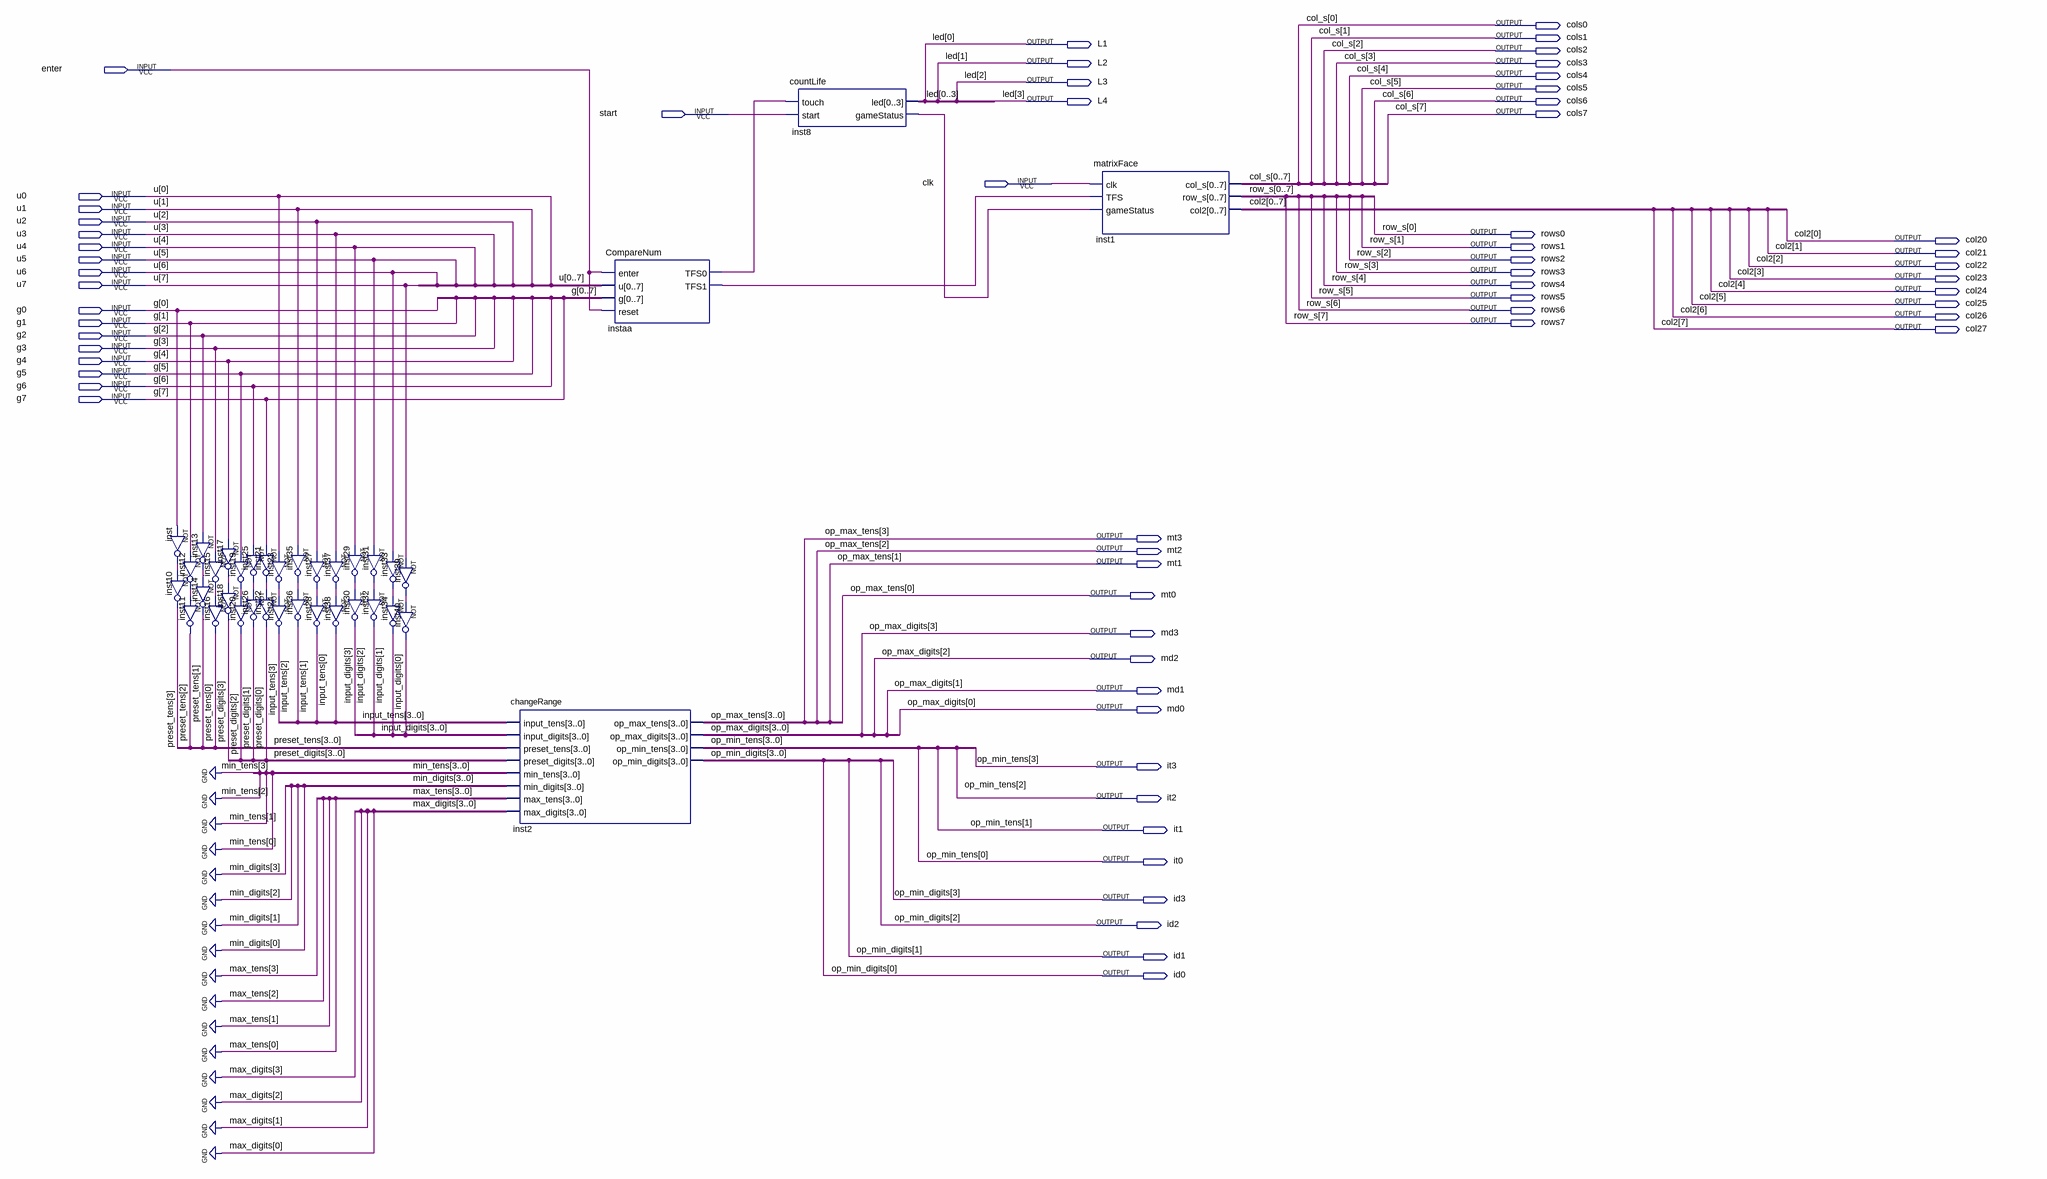
[diagram p0: schematic sheet]
// Quartus schematic projectFull.bdf as structural Verilog: 36 symbols, 63 pins
module projectFull (
  input  enter,
  input  start,
  input  clk,
  input  u0,
  input  u1,
  input  u2,
  input  u3,
  input  u4,
  input  u5,
  input  u6,
  input  u7,
  input  g0,
  input  g1,
  input  g2,
  input  g3,
  input  g4,
  input  g5,
  input  g6,
  input  g7,
  output cols0,
  output cols1,
  output L1,
  output cols2,
  output L2,
  output cols3,
  output cols4,
  output L3,
  output cols5,
  output L4,
  output cols6,
  output cols7,
  output rows0,
  output col20,
  output rows1,
  output col21,
  output rows2,
  output col22,
  output rows3,
  output col23,
  output rows4,
  output col24,
  output rows5,
  output col25,
  output rows6,
  output col26,
  output rows7,
  output col27,
  output mt3,
  output mt2,
  output mt1,
  output mt0,
  output md3,
  output md2,
  output md1,
  output md0,
  output it3,
  output it2,
  output it1,
  output it0,
  output id3,
  output id2,
  output id1,
  output id0
);

  wire inst8_gamestatus, inst12_out, inst13_out, inst15_out, inst17_out, inst19_out, inst21_out, inst23_out,
       inst25_out, inst27_out, inst29_out, inst31_out, inst33_out, inst35_out, inst37_out, inst39_out,
       inst_out, instaa_tfs0, instaa_tfs1;
  wire [3:0] input_digits, input_tens, preset_digits, preset_tens;

  not inst (inst_out, g0);
  not inst13 (inst13_out, g2);
  not inst12 (inst12_out, g1);
  not inst15 (inst15_out, g3);
  not inst10 (preset_tens[3], inst_out);
  not inst14 (preset_tens[1], inst13_out);
  not inst11 (preset_tens[2], inst12_out);
  not inst16 (preset_tens[0], inst15_out);
  not inst17 (inst17_out, g4);
  not inst21 (inst21_out, g7);
  not inst25 (inst25_out, g6);
  not inst19 (inst19_out, g5);
  not inst18 (preset_digits[3], inst17_out);
  not inst22 (preset_digits[0], inst21_out);
  not inst26 (preset_digits[1], inst25_out);
  not inst20 (preset_digits[2], inst19_out);
  not inst35 (inst35_out, u1);
  not inst23 (inst23_out, u0);
  not inst27 (inst27_out, u2);
  not inst36 (input_tens[2], inst35_out);
  not inst24 (input_tens[3], inst23_out);
  not inst28 (input_tens[1], inst27_out);
  not inst29 (inst29_out, u4);
  not inst37 (inst37_out, u3);
  not inst30 (input_digits[3], inst29_out);
  not inst38 (input_tens[0], inst37_out);
  not inst31 (inst31_out, u5);
  not inst33 (inst33_out, u6);
  not inst39 (inst39_out, u7);
  not inst32 (input_digits[2], inst31_out);
  not inst34 (input_digits[1], inst33_out);
  not inst40 (input_digits[0], inst39_out);
  changeRange inst2 (
    .input_tens(input_tens), .input_digits(input_digits), .preset_tens(preset_tens),
    .preset_digits(preset_digits), .min_tens(4'b0000), .min_digits(4'b0000), .max_tens(4'b0000),
    .max_digits(4'b0000), .op_max_tens({mt3, mt2, mt1, mt0}), .op_max_digits({md3, md2, md1, md0}),
    .op_min_tens({it3, it2, it1, it0}), .op_min_digits({id3, id2, id1, id0}));
  CompareNum instaa (
    .enter(enter), .u({u0, u1, u2, u3, u4, u5, u6, u7}), .g({g0, g1, g2, g3, g4, g5, g6, g7}), .reset(enter),
    .TFS0(instaa_tfs0), .TFS1(instaa_tfs1));
  countLife inst8 (.touch(instaa_tfs0), .start(start), .led({L1, L2, L3, L4}), .gameStatus(inst8_gamestatus));
  matrixFace inst1 (
    .clk(clk), .TFS(instaa_tfs1), .gameStatus(inst8_gamestatus),
    .col_s({cols0, cols1, cols2, cols3, cols4, cols5, cols6, cols7}),
    .row_s({rows0, rows1, rows2, rows3, rows4, rows5, rows6, rows7}),
    .col2({col20, col21, col22, col23, col24, col25, col26, col27}));

  // Other names for the same wires on the sheet: col_s[7:0] = {cols7, cols6, cols5, cols4, cols3, cols2, cols1, cols0};
  //   led[3:0] = {L4, L3, L2, L1}; op_max_digits[3:0] = {md3, md2, md1, md0}; op_max_tens[3:0] = {mt3, mt2, mt1, mt0};
  //   op_min_digits[3:0] = {id3, id2, id1, id0}; op_min_tens[3:0] = {it3, it2, it1, it0};
  //   row_s[7:0] = {rows7, rows6, rows5, rows4, rows3, rows2, rows1, rows0}
endmodule
